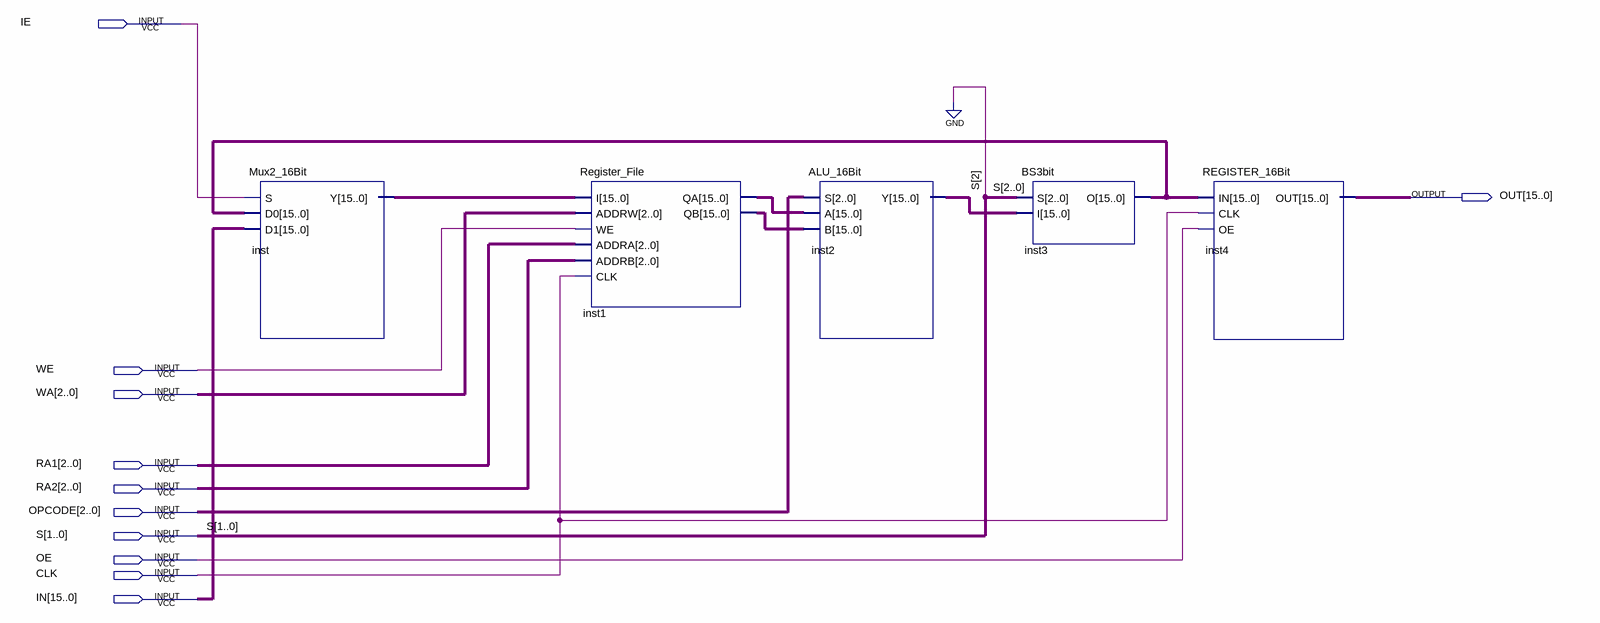
[diagram p0: schematic sheet]
// Quartus schematic DATA_UNIT.bdf as structural Verilog: 5 symbols, 11 pins
module DATA_UNIT (
  input  IE,
  input  WE,
  input  [2:0] WA,
  input  [2:0] RA1,
  input  [2:0] RA2,
  input  [2:0] OPCODE,
  input  [1:0] S,
  input  OE,
  input  CLK,
  input  [15:0] IN,
  output [15:0] OUT
);

  wire [15:0] inst1_qa, inst1_qb, inst2_y, inst3_o, inst_y;

  Mux2_16Bit inst (.S(IE), .D0(inst3_o), .D1(IN), .Y(inst_y));
  Register_File inst1 (
    .I(inst_y), .ADDRW(WA), .WE(WE), .ADDRA(RA1), .ADDRB(RA2), .CLK(CLK), .QA(inst1_qa), .QB(inst1_qb));
  ALU_16Bit inst2 (.S(OPCODE), .A(inst1_qa), .B(inst1_qb), .Y(inst2_y));
  BS3bit inst3 (.S({1'b0, S}), .I(inst2_y), .O(inst3_o));
  REGISTER_16Bit inst4 (.IN(inst3_o), .CLK(CLK), .OE(OE), .OUT(OUT));
endmodule
